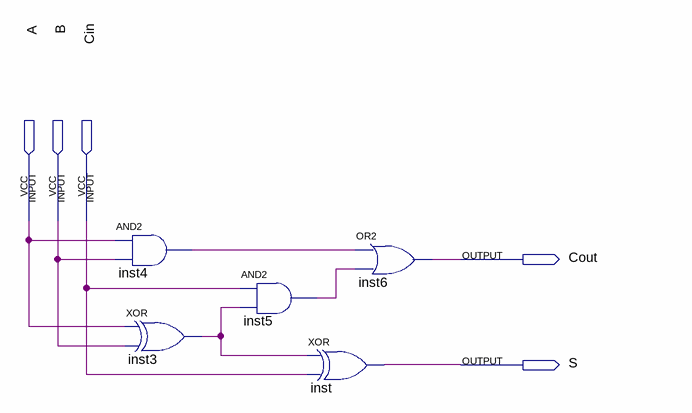
[diagram p0: schematic sheet]
// Quartus schematic DDCA_lab1.bdf as structural Verilog: 5 symbols, 5 pins
module DDCA_lab1 (
  input  A,
  input  B,
  input  Cin,
  output Cout,
  output S
);

  wire inst3_out, inst4_out, inst5_out;

  and inst4 (inst4_out, A, B);
  xor inst3 (inst3_out, A, B);
  and inst5 (inst5_out, Cin, inst3_out);
  xor inst (S, inst3_out, Cin);
  or inst6 (Cout, inst4_out, inst5_out);
endmodule
